# EAGLE design ultrasonic-breakout-pth (EAGLE 7.5.0)
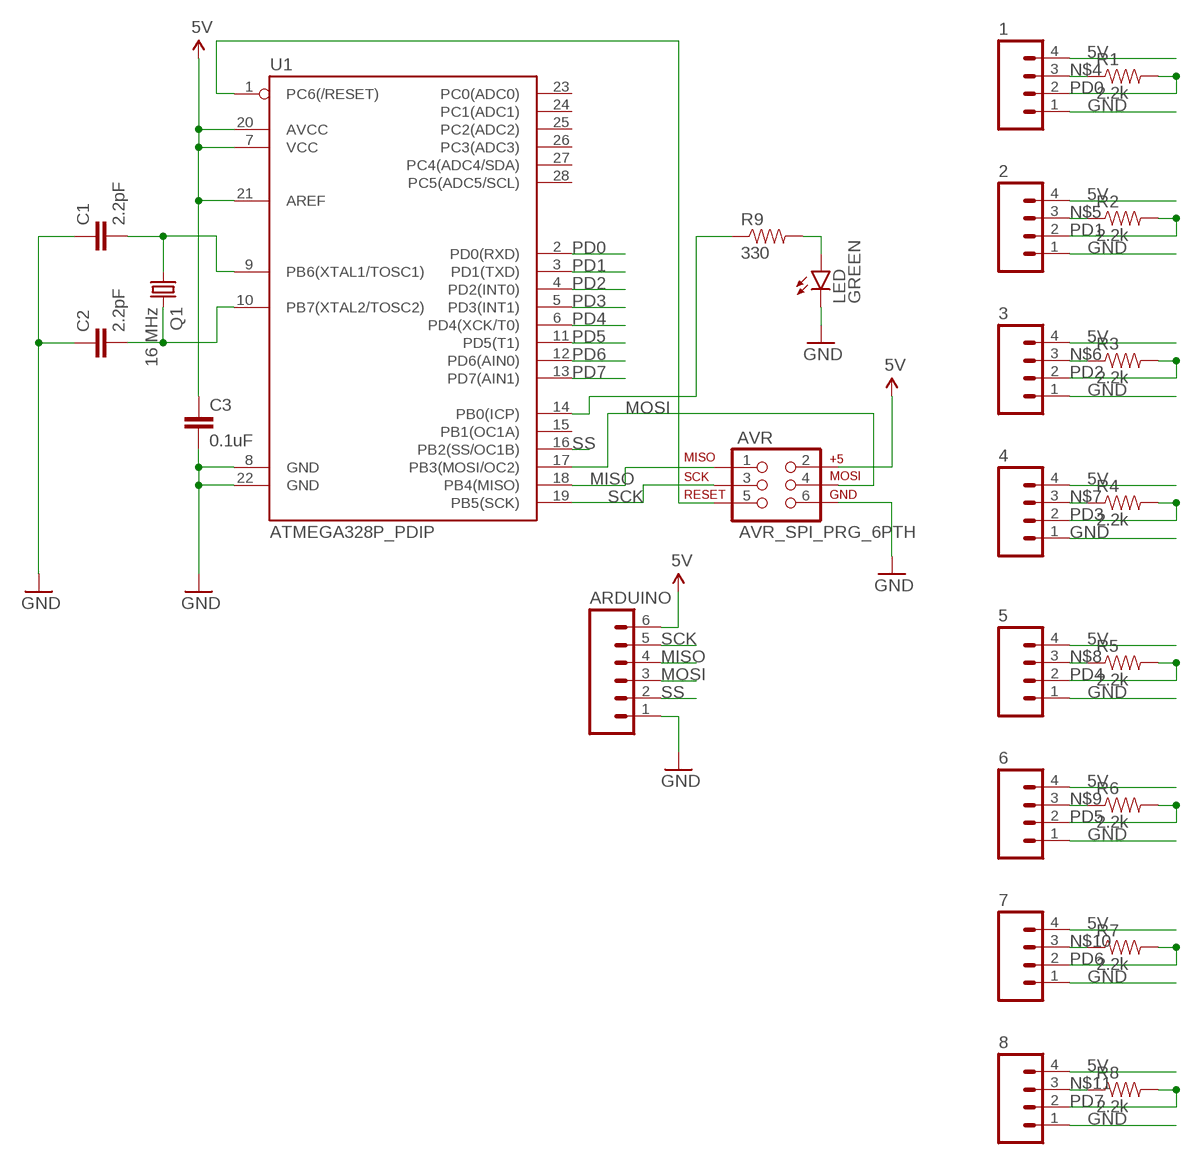
[diagram p0: schematic, sheet 1]

## Parts
1  M04LOCK  [1X04_LOCK]
2  M04LOCK  [1X04_LOCK]
3  M04LOCK  [1X04_LOCK]
4  M04LOCK  [1X04_LOCK]
5  M04LOCK  [1X04_LOCK]
6  M04LOCK  [1X04_LOCK]
7  M04LOCK  [1X04_LOCK]
8  M04LOCK  [1X04_LOCK]
ARDUINO  M06LOCK  [1X06_LOCK]
AVR  AVR_SPI_PRG_6PTH  [2X3]
C1  2.2pF  CAPPTH  [CAP-PTH-SMALL]
C2  2.2pF  CAPPTH  [CAP-PTH-SMALL]
C3  0.1uF  CAPPTH1  [CAP-PTH-5MM]
LED  GREEN  LED5MM  [LED5MM]
Q1  16 MHz  CRYSTALHC49UV  [HC49U-V]
R1  2.2k  RESISTORPTH-1/4W  [AXIAL-0.4]
R2  2.2k  RESISTORPTH-1/4W  [AXIAL-0.4]
R3  2.2k  RESISTORPTH-1/4W  [AXIAL-0.4]
R4  2.2k  RESISTORPTH-1/4W  [AXIAL-0.4]
R5  2.2k  RESISTORPTH-1/4W  [AXIAL-0.4]
R6  2.2k  RESISTORPTH-1/4W  [AXIAL-0.4]
R7  2.2k  RESISTORPTH-1/4W  [AXIAL-0.4]
R8  2.2k  RESISTORPTH-1/4W  [AXIAL-0.4]
R9  330  RESISTORPTH-1/4W  [AXIAL-0.4]
U1  ATMEGA328P_PDIP  [DIL28-3]

## Nets
5V: 1.4 2.4 3.4 4.4 5.4 6.4 7.4 8.4 ARDUINO.6 AVR.2 C3.1 U1.7(VCC) U1.20(AVCC) U1.21(AREF)
GND: 1.1 2.1 3.1 4.1 5.1 6.1 7.1 8.1 ARDUINO.1 AVR.6 C1.1 C2.1 C3.2 LED.K(C) U1.8(GND) U1.22(GND)
MISO: ARDUINO.4 AVR.1 U1.18(PB4(MISO))
MOSI: ARDUINO.3 AVR.4 U1.17(PB3(MOSI/OC2))
N$1: C1.2 Q1.1 U1.9(PB6(XTAL1/TOSC1))
N$2: AVR.5 U1.1(PC6(/RESET))
N$3: C2.2 Q1.2 U1.10(PB7(XTAL2/TOSC2))
N$4: 1.3 R1.P$1
N$5: 2.3 R2.P$1
N$6: 3.3 R3.P$1
N$7: 4.3 R4.P$1
N$8: 5.3 R5.P$1
N$9: 6.3 R6.P$1
N$10: 7.3 R7.P$1
N$11: 8.3 R8.P$1
N$12: R9.P$1 U1.14(PB0(ICP))
N$13: LED.A R9.P$2
PD0: 1.2 R1.P$2 U1.2(PD0(RXD))
PD1: 2.2 R2.P$2 U1.3(PD1(TXD))
PD2: 3.2 R3.P$2 U1.4(PD2(INT0))
PD3: 4.2 R4.P$2 U1.5(PD3(INT1))
PD4: 5.2 R5.P$2 U1.6(PD4(XCK/T0))
PD5: 6.2 R6.P$2 U1.11(PD5(T1))
PD6: 7.2 R7.P$2 U1.12(PD6(AIN0))
PD7: 8.2 R8.P$2 U1.13(PD7(AIN1))
SCK: ARDUINO.5 AVR.3 U1.19(PB5(SCK))
SS: ARDUINO.2 U1.16(PB2(SS/OC1B))
Unconnected: U1.15(PB1(OC1A)) U1.23(PC0(ADC0)) U1.24(PC1(ADC1)) U1.25(PC2(ADC2)) U1.26(PC3(ADC3)) U1.27(PC4(ADC4/SDA)) U1.28(PC5(ADC5/SCL))

## Library data of the parts
1-8 = SparkFun-Connectors:M04: Header 4 Standard 4-pin 0.1" header. Use with straight break away headers (SKU : PRT-00116), right angle break away headers (PRT-00553), swiss pins (PRT-00743), machine pins (PRT-00117), and female headers (PRT-00115). Molex polarized connector foot print use with SKU : PRT-08231 with associated crimp pins and housings. 1MM SMD Version SKU: PRT-10208
ARDUINO = SparkFun-Connectors:M06: Header 6 Standard 6-pin 0.1" header. Use with straight break away headers (SKU : PRT-00116), right angle break away headers (PRT-00553), swiss pins (PRT-00743), machine pins (PRT-00117), and female headers (PRT-00115). Molex polarized connector foot print use with SKU : PRT-08094 with associated crimp pins and housings. NOTES ON THE VARIANTS LOCK and LOCK_LONGPADS... This footprint was designed to help hold the alignment of a through-hole component (i.e. 6-pin header) while soldering it into place. You may notice that each hole has been shifted either up or down by 0.005 of an inch from it's more standard position (which is a perfectly straight line). This slight alteration caused the pins (the squares in the middle) to touch the edges of the holes. Because they are alternating, it causes a "brace" to hold the component in place. 0.005 has proven to be the perfect amount of "off-center" position when using our standard breakaway headers. Although looks a little odd when you look at the bare footprint, once you have a header in there, the alteration is very hard to notice. Also,if you push a header all the way into place, it is covered up entirely on the bottom side. This idea of altering the position of holes to aid alignment will be further integrated into the Sparkfun Library for other footprints. It can help hold any component with 3 or more connection pins.
AVR = SparkFun-Connectors:AVR_SPI_PRG_6: AVR ISP 6 Pin This is the reduced ISP connector for AVR programming. Common on Arduino. This footprint will take up less PCB space and can be used with a 10-pin to 6-pin adapter such as SKU: BOB-08508 **Special note about "TEST_POINT" package. The stop mask is on the top side, so if you want your programming test points to be on the bottom of your board, make sure to place this package on the bottom side of the board. This also ensure that the orientation to program from the bottom side will be correct.
C1 C2 = SparkFun-Passives:CAP: Capacitor Standard 0603 ceramic capacitor, and 0.1" leaded capacitor.
C3 = SparkFun-Capacitors:CAP: Capacitor Standard 0603 ceramic capacitor, and 0.1" leaded capacitor.
LED = SparkFun-LED:LED: LEDs Standard schematic elements and footprints for 5mm, 3mm, 1206, and 0603 sized LEDs. 5mm - Spark Fun Electronics SKU : COM-00529 (and others)
Q1 = SparkFun-FreqCtrl:CRYSTAL: Various standard crystals. Proven footprints.
R1-R9 = SparkFun-Passives:RESISTOR: Resistor Basic schematic elements and footprints for 0603, 1206, and PTH resistors.
U1 = SparkFun-DigitalIC:ATMEGA328P_PDIP: uC used in the Arduino 32kb flash, 1k EEPROM, 2k SRAM This is the through-hole version of this chip.

## Board
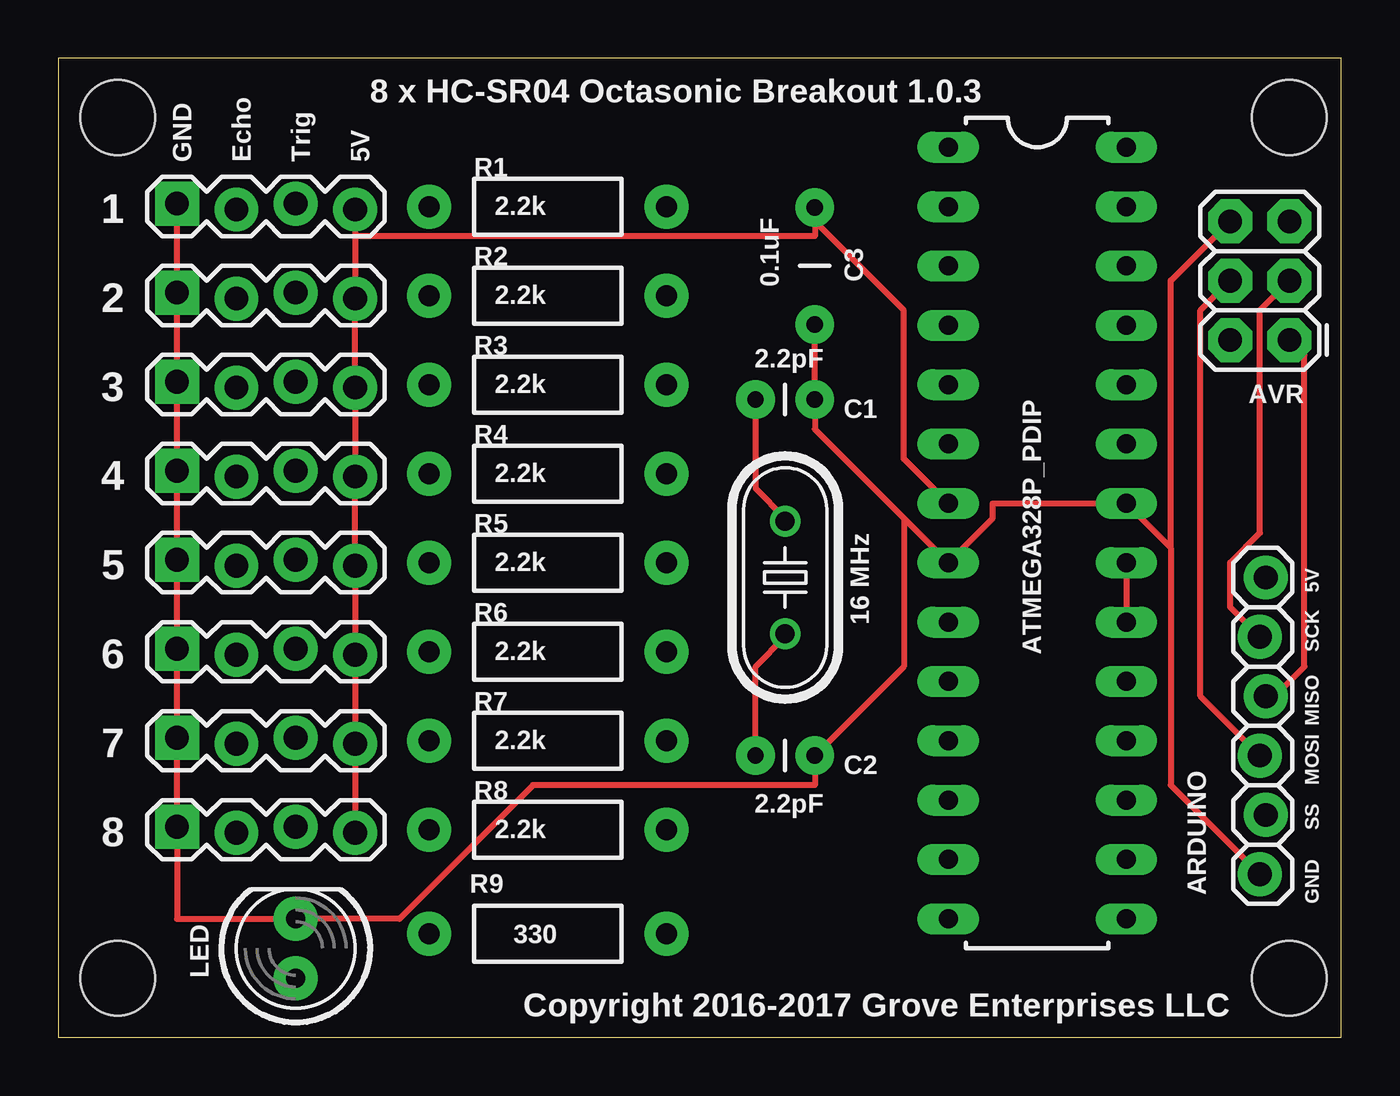
[diagram p1: board, top side]
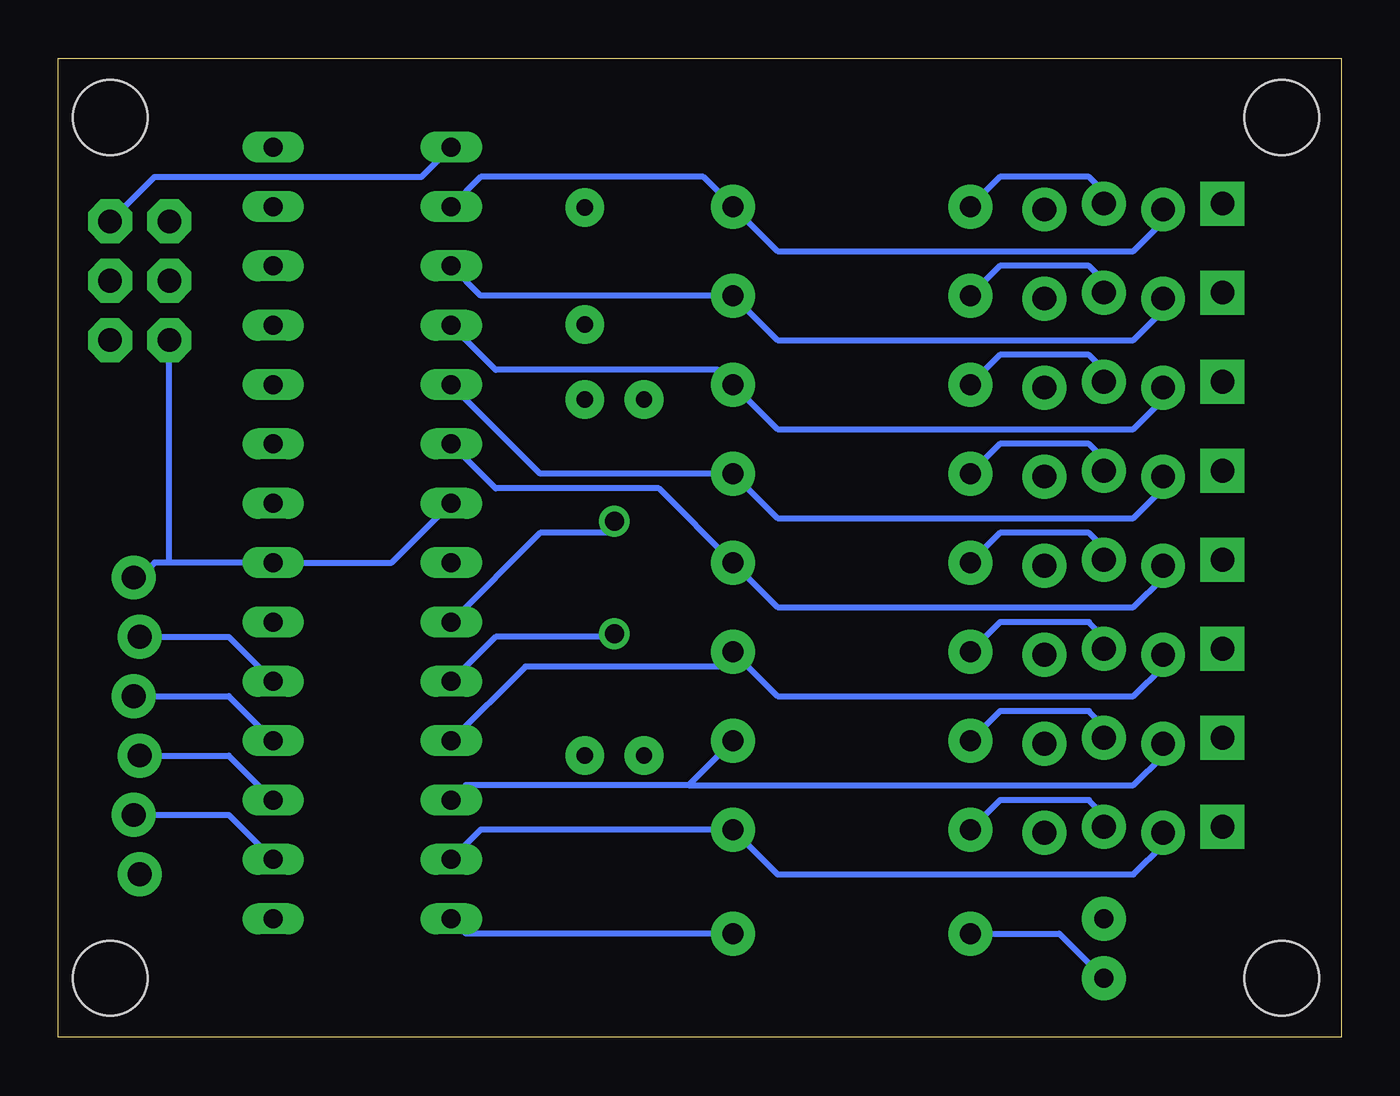
[diagram p2: board, bottom side, seen from below]

Size 54.92 x 41.9 mm. Coordinates in mm from the lower left corner, seen from the top.
Outline: 0,0 54.92,0 54.92,41.9 0,41.9 0,0
Copper layers (1*16): Top 0.035mm / dielectric 1.5mm / Bottom 0.035mm
Design rules "default": minimum track width 10mil, minimum drill 24mil, track to track 8mil, track to pad 8mil, pad to pad 8mil, via to via 8mil, smd to smd 8mil, copper to edge 40mil, drill to drill 8mil, minimum pad ring 10mil, minimum via ring 8mil, stop-mask expansion 4mil, vias tented up to drill 0mil, thermal gap 10mil
Holes 3.2 mm at 2.54,39.37 2.54,2.54 52.71,2.54 52.71,39.37

### Footprints (pad centres in the part's own frame; a part is rotated, then mirrored left to right if it is on the bottom)
1X04_LOCK = drill 1.016 pad 1.88 square: 1 0,0.127 | drill 1.016 pad 1.88: 2 2.54,-0.127; 3 5.08,0.127; 4 7.62,-0.127
1X06_LOCK = drill 1.016 pad 1.88: 1 0,0; 2 2.54,-0.254; 3 5.08,0; 4 7.62,-0.254; 5 10.16,0; 6 12.7,-0.254
2X3 = drill 1.016 pad 1.88 octagon: 1 0,0; 2 0,2.54; 3 2.54,0; 4 2.54,2.54; 5 5.08,0; 6 5.08,2.54
CAP-PTH-SMALL = drill 0.7 pad 1.651: 1 0,0; 2 2.54,0
CAP-PTH-5MM = drill 0.7 pad 1.651: 1 -2.5,0; 2 2.5,0
LED5MM = drill 0.813 pad 1.88: A -1.27,0; K 1.27,0
HC49U-V = drill 0.813: 1 -2.413,0; 2 2.413,0
AXIAL-0.4 = drill 0.9 pad 1.88: P$1 -5.08,0; P$2 5.08,0
DIL28-3 = drill 0.813 long: 1 -16.51,-3.81; 2 -13.97,-3.81; 3 -11.43,-3.81; 4 -8.89,-3.81; 5 -6.35,-3.81; 6 -3.81,-3.81; 7 -1.27,-3.81; 8 1.27,-3.81; 9 3.81,-3.81; 10 6.35,-3.81; 11 8.89,-3.81; 12 11.43,-3.81; 13 13.97,-3.81; 14 16.51,-3.81; 15 16.51,3.81; 16 13.97,3.81; 17 11.43,3.81; 18 8.89,3.81; 19 6.35,3.81; 20 3.81,3.81; 21 1.27,3.81; 22 -1.27,3.81; 23 -3.81,3.81; 24 -6.35,3.81; 25 -8.89,3.81; 26 -11.43,3.81; 27 -13.97,3.81; 28 -16.51,3.81

### Placement (x,y rotation side)
1  5.08,35.56 0 top
2  5.08,31.75 0 top
3  5.08,27.94 0 top
4  5.08,24.13 0 top
5  5.08,20.32 0 top
6  5.08,16.51 0 top
7  5.08,12.7 0 top
8  5.08,8.89 0 top
ARDUINO  51.44,6.98 90 top
AVR  52.71,29.84 90 top
C1  32.39,27.3 180 top
C2  32.39,12.06 180 top
C3  32.39,33.02 270 top
LED  10.16,3.81 90 top
Q1  31.11,19.68 270 top
R1  20.95,35.56 0 top
R2  20.95,31.75 0 top
R3  20.95,27.94 0 top
R4  20.95,24.13 0 top
R5  20.95,20.32 0 top
R6  20.95,16.51 0 top
R7  20.95,12.7 0 top
R8  20.95,8.89 0 top
R9  20.95,4.45 180 top
U1  41.91,21.59 270 top

### Tracks (layer width: path | path; a pad name or v marks a point on that pad's centre or on a via)
5V
  Top 0.254: 1.4 12.7,34.29 | 12.7,34.29 2.4 3.4 4.4 5.4 6.4 7.4 8.4 | U1.21 U1.20 | 32.39,34.93 36.2,31.12 36.2,24.77 U1.7 | 12.7,34.29 32.39,34.29 32.39,34.93 | 32.39,34.93 C3.1
  Bottom 0.254: U1.7 40.64,20.32 U1.21 50.17,20.32 | 50.17,20.32 50.8,20.32 51.44,19.68 ARDUINO.6 | 50.17,20.32 AVR.2
GND
  Top 0.254: 1.1 2.1 3.1 4.1 5.1 6.1 7.1 8.1 5.08,5.08 LED.K 14.61,5.08 20.32,10.8 32.39,10.8 C2.1 36.2,15.88 36.2,22.23 | 36.2,22.23 32.39,26.04 C1.1 C3.2 | 36.2,22.23 U1.8 40.01,22.23 40.01,22.86 U1.22 47.62,20.95 | ARDUINO.1 47.62,10.8 47.62,20.95 | AVR.6 47.62,32.38 47.62,20.95
MISO
  Top 0.254: AVR.1 53.34,29.21 53.34,15.88 52.07,14.6 ARDUINO.4
  Bottom 0.254: U1.18 47.62,14.6 ARDUINO.4
MOSI
  Top 0.254: AVR.4 48.9,31.12 48.9,14.6 ARDUINO.3
  Bottom 0.254: U1.17 47.62,12.06 ARDUINO.3
N$1
  Top 0.254: C1.2 29.85,23.49 31.11,22.23 Q1.1
  Bottom 0.254: U1.9 34.29,21.59 31.11,21.59 Q1.1
N$2
  Bottom 0.254: U1.1 39.37,36.83 50.8,36.83 AVR.5
N$3
  Top 0.254: C2.2 29.85,15.88 31.11,17.14 Q1.2
  Bottom 0.254: U1.10 36.2,17.14 31.11,17.14 Q1.2
N$4
  Bottom 0.254: R1.P$1 14.61,36.83 10.8,36.83 10.16,36.2 1.3
N$5
  Bottom 0.254: R2.P$1 14.61,33.02 10.8,33.02 10.16,32.38 2.3
N$6
  Bottom 0.254: R3.P$1 14.61,29.21 10.8,29.21 10.16,28.57 3.3
N$7
  Bottom 0.254: R4.P$1 14.61,25.4 10.8,25.4 10.16,24.77 4.3
N$8
  Bottom 0.254: R5.P$1 14.61,21.59 10.8,21.59 10.16,20.95 5.3
N$9
  Bottom 0.254: R6.P$1 14.61,17.78 10.8,17.78 10.16,17.14 6.3
N$10
  Bottom 0.254: R7.P$1 14.61,13.97 10.8,13.97 10.16,13.34 7.3
N$11
  Bottom 0.254: R8.P$1 14.61,10.16 10.8,10.16 10.16,9.52 8.3
N$12
  Bottom 0.254: U1.14 37.47,4.45 R9.P$1
N$13
  Bottom 0.254: LED.A 12.07,4.45 R9.P$2
PD0
  Bottom 0.254: U1.2 36.83,36.83 27.3,36.83 R1.P$2 24.13,33.65 8.89,33.65 7.62,34.93 1.2
PD1
  Bottom 0.254: U1.3 36.83,31.75 R2.P$2 24.13,29.84 8.89,29.84 7.62,31.12 2.2
PD2
  Bottom 0.254: U1.4 36.2,28.57 26.67,28.57 R3.P$2 24.13,26.04 8.89,26.04 7.62,27.3 3.2
PD3
  Bottom 0.254: U1.5 34.29,24.13 R4.P$2 24.13,22.23 8.89,22.23 7.62,23.49 4.2
PD4
  Bottom 0.254: U1.6 36.2,23.49 29.21,23.49 R5.P$2 24.13,18.41 8.89,18.41 7.62,19.68 5.2
PD5
  Bottom 0.254: U1.11 34.93,15.88 26.67,15.88 R6.P$2 24.13,14.6 8.89,14.6 7.62,15.88 6.2
PD6
  Bottom 0.254: U1.12 37.47,10.8 27.94,10.8 | R7.P$2 27.94,10.8 | 27.94,10.8 8.89,10.8 7.62,12.06 7.2
PD7
  Bottom 0.254: U1.13 36.83,8.89 R8.P$2 24.13,6.98 8.89,6.98 7.62,8.25 8.2
SCK
  Top 0.254: AVR.3 51.44,31.12 51.44,21.59 50.17,20.32 50.17,18.41 ARDUINO.5
  Bottom 0.254: U1.19 47.62,17.14 ARDUINO.5
SS
  Bottom 0.254: U1.16 47.62,9.52 ARDUINO.2

### Text on the board
tNames: 8 x HC-SR04 Octasonic Breakout 1.0.3 | GND | Echo | Trig | 5V | 5V | SCK | MISO | MOSI | SS | GND | Copyright 2016-2017 Grove Enterprises LLC